# Altium schematic sheet XL1507.SchDoc
size A4; SheetNumber: 1; SheetTotal: 1
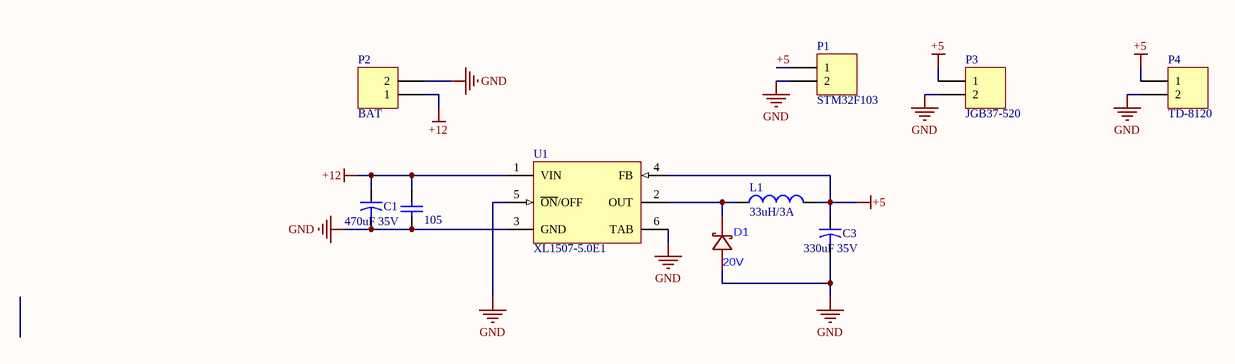
[diagram p0: XL1507.SchDoc]

## Parts
C1  470uF 35V  [C6.3X6.3]
C2  105  [C1210_M]
C3  330uF 35V  [C6.3X6.3]
D1  20V  [DO-214]
L1  33uH/3A  [L7X7]
P1  STM32F103  [XT30-M]
P2  BAT  [XT30-M]
P3  JGB37-520  [XT30-M]
P4  TD-8120  [XT30-M]
U1  XL1507-5.0E1  [TO252-5]

## Nets
+5: C3.1 L1.2 P1.1 P3.1 P4.1 U1.4(FB)
+12: C1.1 C2.2 P2.1 U1.1(VIN)
GND: C1.2 C2.1 C3.2 D1.1(A) P1.2 P2.2 P3.2 P4.2 U1.3(GND) U1.5(~{ON}/OFF) U1.6(TAB)
NetD1_2: D1.2(K) L1.1 U1.2(OUT)

## Library data of the parts
C1 = CAP2: EMZS350ARA471MHA0G; Value: 337; Published: 23-Sep-2002; PackageReference: CAPR5-4X5; Publisher: Altium Limited; PackageDescription: Capacitor; 2 Leads
C2 = C: CL32B105KBHNNNE; BOM名称: 无极性贴片电容; 联系卖家，免费查找封装: 唯一出售店铺网址https://shop463601444.taobao.com; 封装库来自淘宝卖家ID：黄晶宝石: 其他店铺购入均为盗版假冒封装库，请立即申请退款
C3 = CAP2: UCM1V331MNL1GS; Value: 337; Published: 23-Sep-2002; PackageReference: CAPR5-4X5; Publisher: Altium Limited; PackageDescription: Capacitor; 2 Leads
D1 = 1N5820RLG: SS12-E3/61T
L1 = Inductor: FAUL0650-330MT; Code_IEC: 1005; Value: 47uH; Published: 8-Jun-2000; LatestRevisionDate: 29-May-2009; LatestRevisionNote: IPC-7351 Footprint Added.; PackageReference: 0402-A; Publisher: Altium Limited; PackageDescription: Chip Inductor; Code_JEITA: 0402
P1-P4 = Header 2: Header, 2-Pin; LatestRevisionDate: 17-Jul-2002; LatestRevisionNote: Re-released for DXP Platform.; Publisher: Altium Limited
U1 = LM2596S-5.0: 12V-5V; Manufacturer: National Semiconductor; PackageTopMarking: NSUZXYTTE#*LM2596S*-5.0 P+; PowerWise: N; CompType: Switcher; High-Reliability: Y; DatasheetVersion: May-2002; PackageVersion: revD, Apr-2005; PackageReference: TS5B; PackageDescription: TO-263, Molded, .400 x .390 x .180in, 5 Lead, .067in Pitch, Surface Mount; PartNumber: LM2596S-5.0; RoHS: N; PinCount: 5; Code_JEDEC: MO-169-AB; ComponentLink1Description: Manufacturer URL; ComponentLink1URL: http://www.national.com/; ComponentLink2Description: LM2596 Datasheet; ComponentLink2URL: http://www.national.com/ds/LM/LM2596.pdf; ComponentLink3Description: LM2596 Web Page; ComponentLink3URL: http://www.national.com/pf/LM/LM2596.html; ComponentLink4Description: TS5B Package Page; ComponentLink4URL: http://www.national.com/packaging/folders/ts5b.html